# Altium schematic sheet Picocopter_Edit.SchDoc
size A
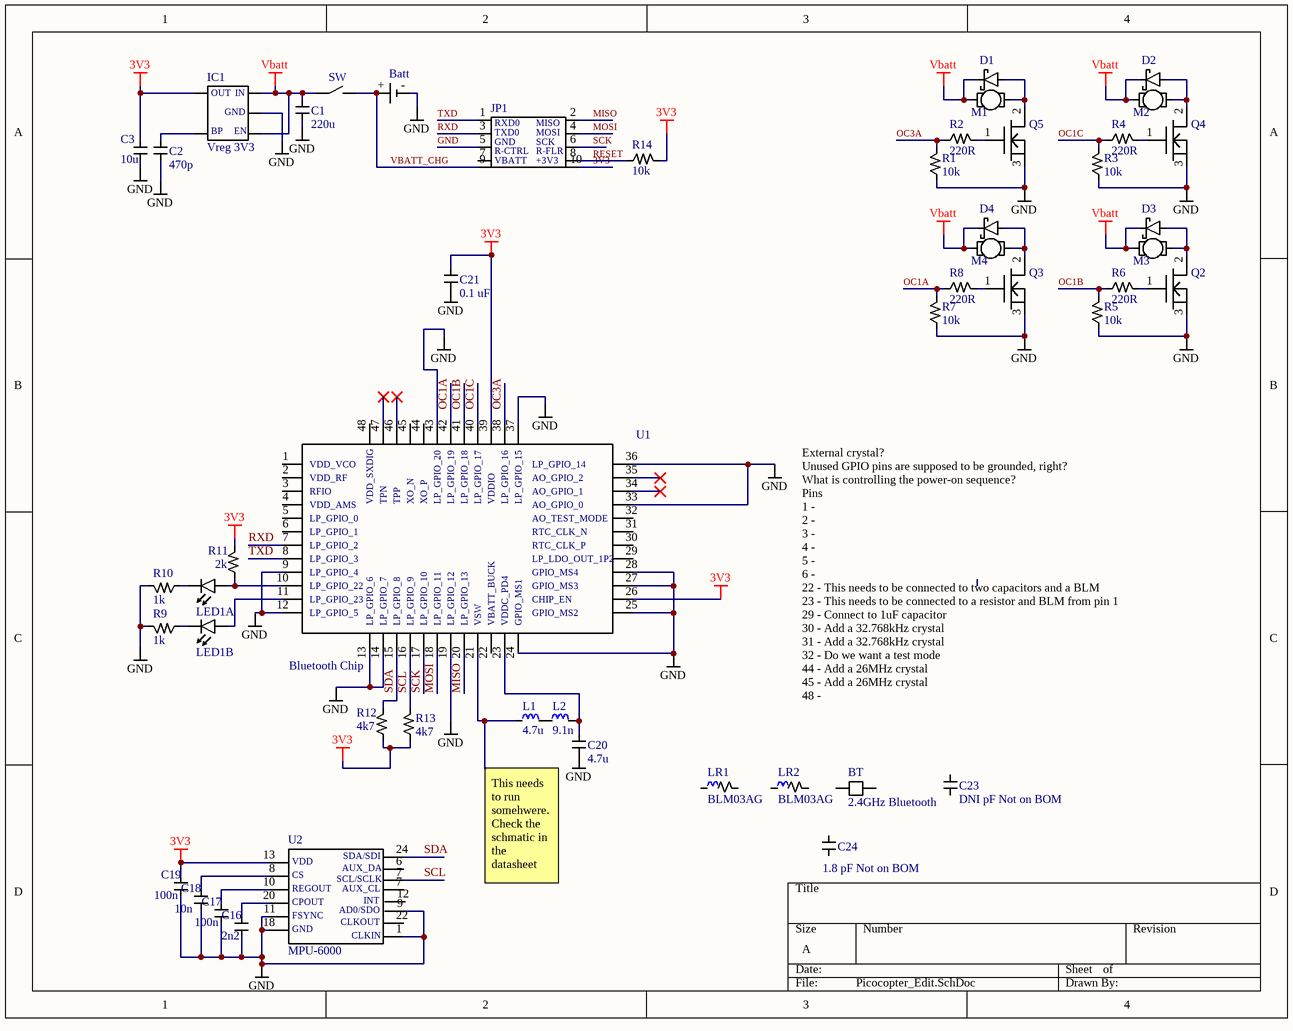
[diagram p0: Picocopter_Edit.SchDoc]

## Parts
Batt  Battery  [Battery]  (value not drawn)
BT  2.4GHz Bluetooth  [2.4GHz Bluetooth]
C1  220u  [1206 Capacitor]
C2  470p  [0201 Capacitor]
C3  10u  [0402 Capacitor]
C16  2n2  [0603 Capacitor]
C17  100n  [0603 Capacitor]
C18  10n  [0603 Capacitor]
C19  100n  [0603 Capacitor]
C20  4.7u  [0603 Capacitor]
C21  0.1 uF  [0201 Capacitor]
C23  DNI pF Not on BOM  [0201 Capacitor]
C24  1.8 pF Not on BOM  [0201 Capacitor]
D1  Schottky Diode  [Schottky Diode]  (value not drawn)
D2  Schottky Diode  [Schottky Diode]  (value not drawn)
D3  Schottky Diode  [Schottky Diode]  (value not drawn)
D4  Schottky Diode  [Schottky Diode]  (value not drawn)
IC1  Vreg 3V3  [Voltage Regulator]
JP1  10 Pin Connector  [10 Pin Connector]  (value not drawn)
L1  4.7u  [INDC2924X10N]
L2  9.1n  [PCBComponent_1 - duplicate]
LED1A  PicoLED  [DFN70P60X45-2N]  (value not drawn)
LED1B  PicoLED  [DFN70P60X45-2N]  (value not drawn)
LR1  BLM03AG  [INDC0603X10N]
LR2  BLM03AG  [INDC0603X10N]
M1  Motor  [Battery]  (value not drawn)
M2  Motor  [Battery]  (value not drawn)
M3  Motor  [Battery]  (value not drawn)
M4  Motor  [Battery]  (value not drawn)
Q2  N-Channel MOSFET  [N-Channel MOSFET]  (value not drawn)
Q3  N-Channel MOSFET  [N-Channel MOSFET]  (value not drawn)
Q4  N-Channel MOSFET  [N-Channel MOSFET]  (value not drawn)
Q5  MOSFET  [N-Channel MOSFET]  (value not drawn)
R1  10k  [0402 Resistor]
R2  220R  [0402 Resistor]
R3  10k  [0402 Resistor]
R4  220R  [0402 Resistor]
R5  10k  [0402 Resistor]
R6  220R  [0402 Resistor]
R7  10k  [0402 Resistor]
R8  220R  [0402 Resistor]
R9  1k  [0402 Resistor]
R10  1k  [0402 Resistor]
R11  2k  [0402 Resistor]
R12  4k7  [0402 Resistor]
R13  4k7  [0402 Resistor]
R14  10k  [0402 Resistor]
SW  2 Pin Header  [2 Pin Header]  (value not drawn)
U1  Bluetooth Chip  [QFN40P600X600X10_HS-49N]
U2  MPU-6000  [Accelerometer]

## Nets
3V3: C3.2 C19.2 C21.1 IC1.1 JP1.10 R11.2 R12.1 R13.1 R14.2 U1.26 U1.39 U2.13
GND: Batt.- C1.1 C2.1 C3.1 C16.1 C17.1 C18.1 C19.1 C20.1 C21.2 IC1.4 JP1.5 Q2.3 Q3.3 Q4.3 Q5.3 R1.1 R3.1 R5.1 R7.1 R9.2 R10.2 U1.9 U1.12 U1.13 U1.14 U1.19 U1.24 U1.25 U1.27 U1.28 U1.33 U1.36 U1.37 U1.43 U2.1 U2.9 U2.11 U2.18
Vbatt: C1.2 D1.2 D2.2 D3.2 D4.2 IC1.3 IC1.5 M1.3 M2.3 M3.3 M4.3 SW.5
MISO: JP1.2 U1.20
MOSI: JP1.4 U1.18
OC1A: R7.2 R8.1 U1.42
OC1B: R5.2 R6.1 U1.41
OC1C: R3.2 R4.1 U1.40
OC3A: R1.2 R2.1 U1.38
RESET: JP1.8 R14.1
RXD: JP1.3 U1.7
SCK: JP1.6 U1.17
SCL: R13.2 U1.16 U2.7
SDA: R12.2 U1.15 U2.24
TXD: JP1.1 U1.8
VBATT_CHG: Batt.+ JP1.9 SW.6
NetC2_2: C2.2 IC1.2
NetC16_2: C16.2 U2.20
NetC17_2: C17.2 U2.10
NetC18_2: C18.2 U2.8
NetC20_2: C20.2 L2.0 U1.23
NetD1_1: D1.1 M1.4 Q5.2
NetD2_1: D2.1 M2.4 Q4.2
NetD3_1: D3.1 M3.4 Q2.2
NetD4_1: D4.1 M4.4 Q3.2
NetL1_0: L1.0 L2.1
NetL1_1: L1.1 U1.21
NetLED1A_1: LED1A.1 R11.1 U1.10
NetLED1A_2: LED1A.2 R10.1
NetLED1B_1: LED1B.1 U1.11
NetLED1B_2: LED1B.2 R9.1
NetQ2_1: Q2.1 R6.2
NetQ3_1: Q3.1 R8.2
NetQ4_1: Q4.1 R4.2
NetQ5_1: Q5.1 R2.2

Not connected (* = marked no-connect by the designer): BT 1 2; C23 1 2; C24 1 2; JP1 7; LR1 0 1; LR2 0 1; U1 1 2 3 4 5 6 22 29 30 31 32 34* 35* 44 45 46* 47* 48; U2 6 12 22

## Notes on the sheet
- External crystal?
  Unused GPIO pins are supposed to be grounded, right?
  What is controlling the power-on sequence?
  Pins
  1 -
  2 -
  3 -
  4 -
  5 -
  6 -
  22 - This needs to be connected to two capacitors and a BLM
  23 - This needs to be connected to a resistor and BLM from pin 1
  29 - Connect to 1uF capacitor
  30 - Add a 32.768kHz crystal
  31 - Add a 32.768kHz crystal
  32 - Do we want a test mode
  44 - Add a 26MHz crystal
  45 - Add a 26MHz crystal
  48 -
- (near C20) This needs to run somehwere. Check the schmatic in the datasheet
- (in symbol 10 Pin Connector) RXD0; MISO; TXD0; MOSI; GND; SCK; R-CTRL; R-FLR; VBATT; +3V3
- (in symbol Accelerometer) SDA/SDI; VDD; AUX_DA; CS; SCL/SCLK; REGOUT; AUX_CL; CPOUT; INT; AD0/SDO; FSYNC; CLKOUT; GND; CLKIN
- (in symbol Component_1) VDD_VCO; LP_GPIO_14; VDD_RF; AO_GPIO_2; RFIO; AO_GPIO_1; VDD_SXDIG; TPN; TPP; XO_N; XO_P; LP_GPIO_20; LP_GPIO_19; LP_GPIO_18; LP_GPIO_17; VDDIO; LP_GPIO_16; LP_GPIO_15; VDD_AMS; AO_GPIO_0; LP_GPIO_0; AO_TEST_MODE; LP_GPIO_1; RTC_CLK_N; LP_GPIO_2; RTC_CLK_P; LP_GPIO_3; LP_LDO_OUT_1P2; LP_GPIO_4; GPIO_MS4; LP_GPIO_22; GPIO_MS3; LP_GPIO_23; CHIP_EN; LP_GPIO_5; GPIO_MS2; LP_GPIO_6; LP_GPIO_7; LP_GPIO_8; LP_GPIO_9; LP_GPIO_10; LP_GPIO_11; LP_GPIO_12; LP_GPIO_13; VSW; VBATT_BUCK; VDDC_PD4; GPIO_MS1
- (in symbol Voltage Regulator) OUT; IN; GND; BP; EN

## Library data of the parts
C1 = 1206 Capacitor
C2 C21 C23 C24 = 10 pF Capacitor
C3 = 0402 Capacitor
C16-C20 = 0603 Capacitor
IC1 = Voltage Regulator
L1 L2 LR1 LR2 U1 = Component_1
Q5 = N-Channel MOSFET
R1-R14 = 0402 Resistor
U2 = Accelerometer